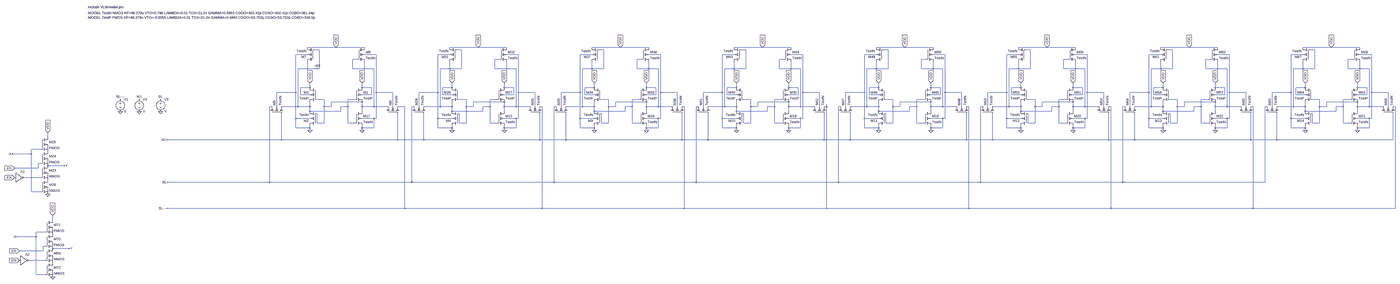
[diagram p0: schematic 40nmDraft1.asc, whole sheet]
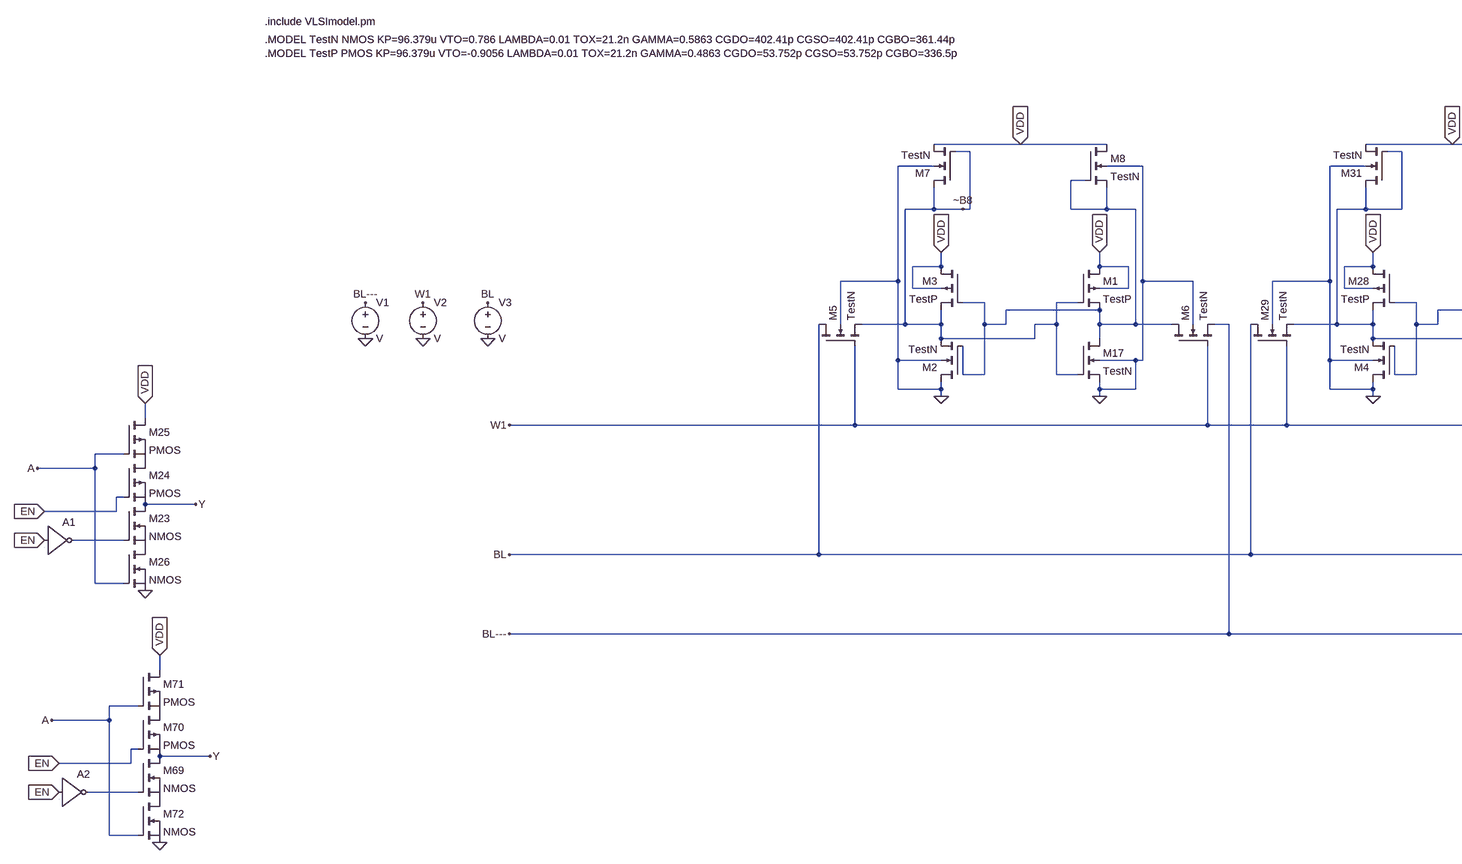
[diagram p1: schematic 40nmDraft1.asc, part, row 1 of 1, column 1 of 3]
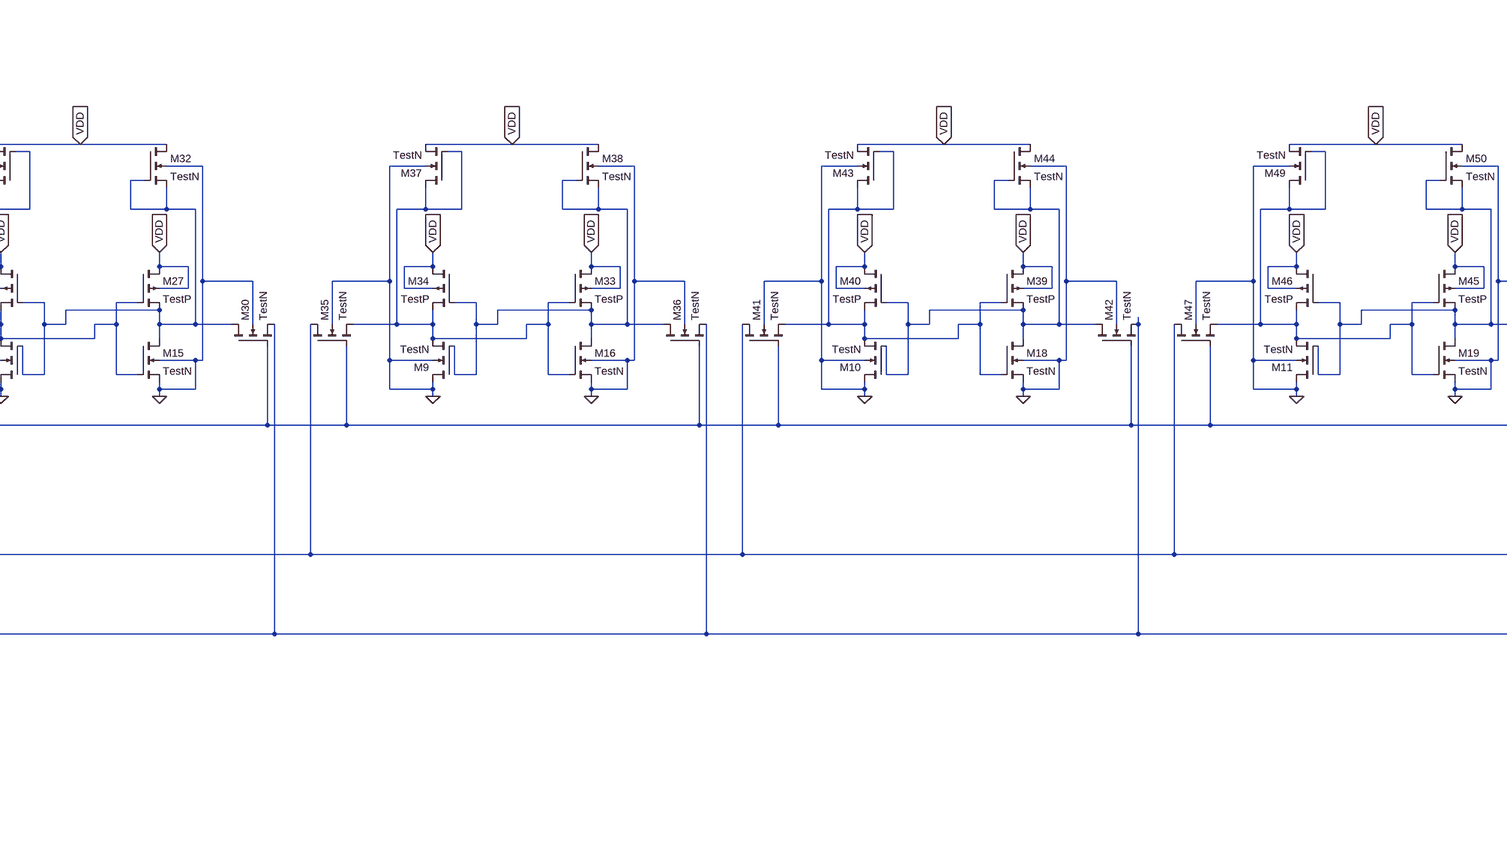
[diagram p2: schematic 40nmDraft1.asc, part, row 1 of 1, column 2 of 3]
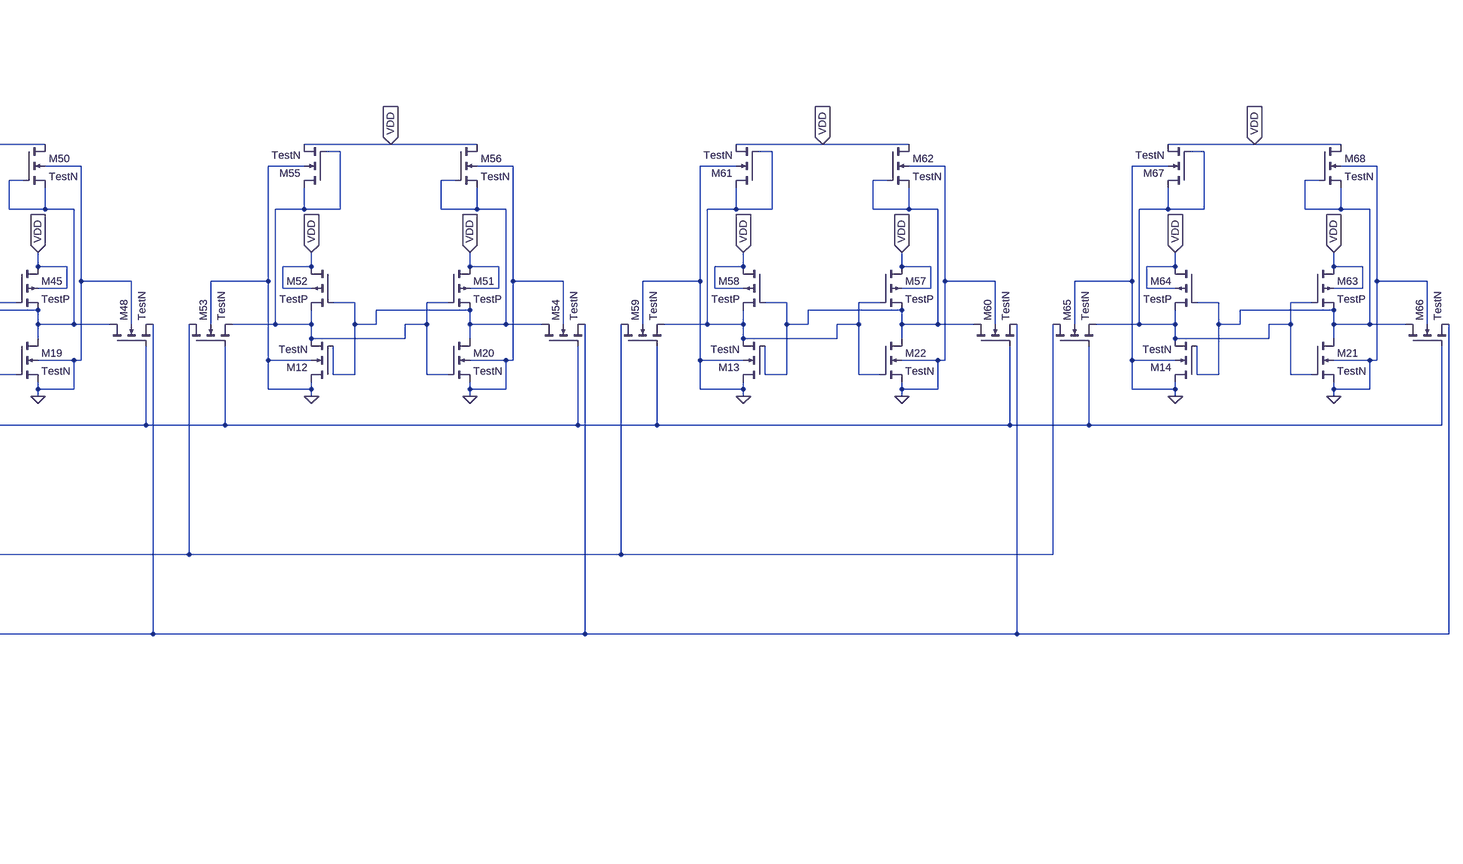
[diagram p3: schematic 40nmDraft1.asc, part, row 1 of 1, column 3 of 3]
40nmDraft1.asc, the LTspice schematic file:
Version 4
SHEET 1 5016 1524
WIRE -2144 -48 -2336 -48
WIRE -1952 -48 -2144 -48
WIRE -1184 -48 -1376 -48
WIRE -992 -48 -1184 -48
WIRE -224 -48 -416 -48
WIRE -32 -48 -224 -48
WIRE 736 -48 544 -48
WIRE 928 -48 736 -48
WIRE 1696 -48 1504 -48
WIRE 1888 -48 1696 -48
WIRE 2656 -48 2464 -48
WIRE 2848 -48 2656 -48
WIRE 3616 -48 3424 -48
WIRE 3808 -48 3616 -48
WIRE 4576 -48 4384 -48
WIRE 4768 -48 4576 -48
WIRE -2256 -32 -2288 -32
WIRE -1296 -32 -1328 -32
WIRE -336 -32 -368 -32
WIRE 624 -32 592 -32
WIRE 1584 -32 1552 -32
WIRE 2544 -32 2512 -32
WIRE 3504 -32 3472 -32
WIRE 4464 -32 4432 -32
WIRE -2336 0 -2416 0
WIRE -1872 0 -1952 0
WIRE -1376 0 -1456 0
WIRE -912 0 -992 0
WIRE -416 0 -496 0
WIRE 48 0 -32 0
WIRE 544 0 464 0
WIRE 1008 0 928 0
WIRE 1504 0 1424 0
WIRE 1968 0 1888 0
WIRE 2464 0 2384 0
WIRE 2928 0 2848 0
WIRE 3424 0 3344 0
WIRE 3888 0 3808 0
WIRE 4384 0 4304 0
WIRE 4848 0 4768 0
WIRE -2000 32 -2032 32
WIRE -1040 32 -1072 32
WIRE -80 32 -112 32
WIRE 880 32 848 32
WIRE 1840 32 1808 32
WIRE 2800 32 2768 32
WIRE 3760 32 3728 32
WIRE 4720 32 4688 32
WIRE -2336 96 -2336 48
WIRE -2336 96 -2400 96
WIRE -2272 96 -2336 96
WIRE -2256 96 -2256 -32
WIRE -2256 96 -2272 96
WIRE -2032 96 -2032 32
WIRE -1952 96 -1952 48
WIRE -1952 96 -2032 96
WIRE -1888 96 -1952 96
WIRE -1376 96 -1376 48
WIRE -1376 96 -1440 96
WIRE -1296 96 -1296 -32
WIRE -1296 96 -1376 96
WIRE -1072 96 -1072 32
WIRE -992 96 -992 48
WIRE -992 96 -1072 96
WIRE -928 96 -992 96
WIRE -416 96 -416 48
WIRE -416 96 -480 96
WIRE -336 96 -336 -32
WIRE -336 96 -416 96
WIRE -112 96 -112 32
WIRE -32 96 -32 48
WIRE -32 96 -112 96
WIRE 32 96 -32 96
WIRE 544 96 544 48
WIRE 544 96 480 96
WIRE 624 96 624 -32
WIRE 624 96 544 96
WIRE 848 96 848 32
WIRE 928 96 928 48
WIRE 928 96 848 96
WIRE 992 96 928 96
WIRE 1504 96 1504 48
WIRE 1504 96 1440 96
WIRE 1584 96 1584 -32
WIRE 1584 96 1504 96
WIRE 1808 96 1808 32
WIRE 1888 96 1888 48
WIRE 1888 96 1808 96
WIRE 1952 96 1888 96
WIRE 2464 96 2464 48
WIRE 2464 96 2400 96
WIRE 2544 96 2544 -32
WIRE 2544 96 2464 96
WIRE 2768 96 2768 32
WIRE 2848 96 2848 48
WIRE 2848 96 2768 96
WIRE 2912 96 2848 96
WIRE 3424 96 3424 48
WIRE 3424 96 3360 96
WIRE 3504 96 3504 -32
WIRE 3504 96 3424 96
WIRE 3728 96 3728 32
WIRE 3808 96 3808 48
WIRE 3808 96 3728 96
WIRE 3872 96 3808 96
WIRE 4384 96 4384 48
WIRE 4384 96 4320 96
WIRE 4464 96 4464 -32
WIRE 4464 96 4384 96
WIRE 4688 96 4688 32
WIRE 4768 96 4768 48
WIRE 4768 96 4688 96
WIRE 4832 96 4768 96
WIRE -2320 224 -2320 192
WIRE -2320 224 -2384 224
WIRE -1968 224 -1968 192
WIRE -1904 224 -1968 224
WIRE -1360 224 -1360 192
WIRE -1360 224 -1424 224
WIRE -1008 224 -1008 192
WIRE -944 224 -1008 224
WIRE -400 224 -400 192
WIRE -400 224 -464 224
WIRE -48 224 -48 192
WIRE 16 224 -48 224
WIRE 560 224 560 192
WIRE 560 224 496 224
WIRE 912 224 912 192
WIRE 976 224 912 224
WIRE 1520 224 1520 192
WIRE 1520 224 1456 224
WIRE 1872 224 1872 192
WIRE 1936 224 1872 224
WIRE 2480 224 2480 192
WIRE 2480 224 2416 224
WIRE 2832 224 2832 192
WIRE 2896 224 2832 224
WIRE 3440 224 3440 192
WIRE 3440 224 3376 224
WIRE 3792 224 3792 192
WIRE 3856 224 3792 224
WIRE 4400 224 4400 192
WIRE 4400 224 4336 224
WIRE 4752 224 4752 192
WIRE 4816 224 4752 224
WIRE -2416 256 -2416 0
WIRE -2416 256 -2544 256
WIRE -1872 256 -1872 0
WIRE -1760 256 -1872 256
WIRE -1456 256 -1456 0
WIRE -1456 256 -1584 256
WIRE -912 256 -912 0
WIRE -800 256 -912 256
WIRE -496 256 -496 0
WIRE -496 256 -624 256
WIRE 48 256 48 0
WIRE 160 256 48 256
WIRE 464 256 464 0
WIRE 464 256 336 256
WIRE 1008 256 1008 0
WIRE 1120 256 1008 256
WIRE 1424 256 1424 0
WIRE 1424 256 1296 256
WIRE 1968 256 1968 0
WIRE 2080 256 1968 256
WIRE 2384 256 2384 0
WIRE 2384 256 2256 256
WIRE 2928 256 2928 0
WIRE 3040 256 2928 256
WIRE 3344 256 3344 0
WIRE 3344 256 3216 256
WIRE 3888 256 3888 0
WIRE 4000 256 3888 256
WIRE 4304 256 4304 0
WIRE 4304 256 4176 256
WIRE 4848 256 4848 0
WIRE 4960 256 4848 256
WIRE -2384 272 -2384 224
WIRE -2320 272 -2384 272
WIRE -1904 272 -1904 224
WIRE -1904 272 -1968 272
WIRE -1424 272 -1424 224
WIRE -1360 272 -1424 272
WIRE -944 272 -944 224
WIRE -944 272 -1008 272
WIRE -464 272 -464 224
WIRE -400 272 -464 272
WIRE 16 272 16 224
WIRE 16 272 -48 272
WIRE 496 272 496 224
WIRE 560 272 496 272
WIRE 976 272 976 224
WIRE 976 272 912 272
WIRE 1456 272 1456 224
WIRE 1520 272 1456 272
WIRE 1936 272 1936 224
WIRE 1936 272 1872 272
WIRE 2416 272 2416 224
WIRE 2480 272 2416 272
WIRE 2896 272 2896 224
WIRE 2896 272 2832 272
WIRE 3376 272 3376 224
WIRE 3440 272 3376 272
WIRE 3856 272 3856 224
WIRE 3856 272 3792 272
WIRE 4336 272 4336 224
WIRE 4400 272 4336 272
WIRE 4816 272 4816 224
WIRE 4816 272 4752 272
WIRE -2224 304 -2272 304
WIRE -2016 304 -2064 304
WIRE -1264 304 -1312 304
WIRE -1056 304 -1104 304
WIRE -304 304 -352 304
WIRE -96 304 -144 304
WIRE 656 304 608 304
WIRE 864 304 816 304
WIRE 1616 304 1568 304
WIRE 1824 304 1776 304
WIRE 2576 304 2528 304
WIRE 2784 304 2736 304
WIRE 3536 304 3488 304
WIRE 3744 304 3696 304
WIRE 4496 304 4448 304
WIRE 4704 304 4656 304
WIRE -1968 320 -2176 320
WIRE -1008 320 -1216 320
WIRE -48 320 -256 320
WIRE 912 320 704 320
WIRE 1872 320 1664 320
WIRE 2832 320 2624 320
WIRE 3792 320 3584 320
WIRE 4752 320 4544 320
WIRE -2544 352 -2544 256
WIRE -2400 352 -2400 96
WIRE -2400 352 -2496 352
WIRE -2320 352 -2320 320
WIRE -2320 352 -2400 352
WIRE -2224 352 -2224 304
WIRE -2176 352 -2176 320
WIRE -2176 352 -2224 352
WIRE -2064 352 -2064 304
WIRE -2064 352 -2112 352
WIRE -1968 352 -1968 320
WIRE -1888 352 -1888 96
WIRE -1888 352 -1968 352
WIRE -1808 352 -1888 352
WIRE -1760 352 -1760 256
WIRE -1680 352 -1712 352
WIRE -1584 352 -1584 256
WIRE -1440 352 -1440 96
WIRE -1440 352 -1536 352
WIRE -1360 352 -1360 320
WIRE -1360 352 -1440 352
WIRE -1264 352 -1264 304
WIRE -1216 352 -1216 320
WIRE -1216 352 -1264 352
WIRE -1104 352 -1104 304
WIRE -1104 352 -1152 352
WIRE -1008 352 -1008 320
WIRE -928 352 -928 96
WIRE -928 352 -1008 352
WIRE -848 352 -928 352
WIRE -800 352 -800 256
WIRE -624 352 -624 256
WIRE -480 352 -480 96
WIRE -480 352 -576 352
WIRE -400 352 -400 320
WIRE -400 352 -480 352
WIRE -304 352 -304 304
WIRE -256 352 -256 320
WIRE -256 352 -304 352
WIRE -144 352 -144 304
WIRE -144 352 -192 352
WIRE -48 352 -48 320
WIRE 32 352 32 96
WIRE 32 352 -48 352
WIRE 112 352 32 352
WIRE 160 352 160 256
WIRE 336 352 336 256
WIRE 480 352 480 96
WIRE 480 352 384 352
WIRE 560 352 560 320
WIRE 560 352 480 352
WIRE 656 352 656 304
WIRE 704 352 704 320
WIRE 704 352 656 352
WIRE 816 352 816 304
WIRE 816 352 768 352
WIRE 912 352 912 320
WIRE 992 352 992 96
WIRE 992 352 912 352
WIRE 1072 352 992 352
WIRE 1120 352 1120 256
WIRE 1168 352 1168 336
WIRE 1296 352 1296 256
WIRE 1440 352 1440 96
WIRE 1440 352 1344 352
WIRE 1520 352 1520 320
WIRE 1520 352 1440 352
WIRE 1616 352 1616 304
WIRE 1664 352 1664 320
WIRE 1664 352 1616 352
WIRE 1776 352 1776 304
WIRE 1776 352 1728 352
WIRE 1872 352 1872 320
WIRE 1952 352 1952 96
WIRE 1952 352 1872 352
WIRE 2032 352 1952 352
WIRE 2080 352 2080 256
WIRE 2256 352 2256 256
WIRE 2400 352 2400 96
WIRE 2400 352 2304 352
WIRE 2480 352 2480 320
WIRE 2480 352 2400 352
WIRE 2576 352 2576 304
WIRE 2624 352 2624 320
WIRE 2624 352 2576 352
WIRE 2736 352 2736 304
WIRE 2736 352 2688 352
WIRE 2832 352 2832 320
WIRE 2912 352 2912 96
WIRE 2912 352 2832 352
WIRE 2992 352 2912 352
WIRE 3040 352 3040 256
WIRE 3216 352 3216 256
WIRE 3360 352 3360 96
WIRE 3360 352 3264 352
WIRE 3440 352 3440 320
WIRE 3440 352 3360 352
WIRE 3536 352 3536 304
WIRE 3584 352 3584 320
WIRE 3584 352 3536 352
WIRE 3696 352 3696 304
WIRE 3696 352 3648 352
WIRE 3792 352 3792 320
WIRE 3872 352 3872 96
WIRE 3872 352 3792 352
WIRE 3952 352 3872 352
WIRE 4000 352 4000 256
WIRE 4176 352 4176 256
WIRE 4320 352 4320 96
WIRE 4320 352 4224 352
WIRE 4400 352 4400 320
WIRE 4400 352 4320 352
WIRE 4496 352 4496 304
WIRE 4544 352 4544 320
WIRE 4544 352 4496 352
WIRE 4656 352 4656 304
WIRE 4656 352 4608 352
WIRE 4752 352 4752 320
WIRE 4832 352 4832 96
WIRE 4832 352 4752 352
WIRE 4912 352 4832 352
WIRE 4960 352 4960 256
WIRE -2320 384 -2320 352
WIRE -2112 384 -2112 352
WIRE -2112 384 -2320 384
WIRE -1968 384 -1968 352
WIRE -1360 384 -1360 352
WIRE -1152 384 -1152 352
WIRE -1152 384 -1360 384
WIRE -1008 384 -1008 352
WIRE -400 384 -400 352
WIRE -192 384 -192 352
WIRE -192 384 -400 384
WIRE -48 384 -48 352
WIRE 560 384 560 352
WIRE 768 384 768 352
WIRE 768 384 560 384
WIRE 912 384 912 352
WIRE 1520 384 1520 352
WIRE 1728 384 1728 352
WIRE 1728 384 1520 384
WIRE 1872 384 1872 352
WIRE 2480 384 2480 352
WIRE 2688 384 2688 352
WIRE 2688 384 2480 384
WIRE 2832 384 2832 352
WIRE 3440 384 3440 352
WIRE 3648 384 3648 352
WIRE 3648 384 3440 384
WIRE 3792 384 3792 352
WIRE 4400 384 4400 352
WIRE 4608 384 4608 352
WIRE 4608 384 4400 384
WIRE 4752 384 4752 352
WIRE -2416 432 -2416 256
WIRE -2320 432 -2416 432
WIRE -1888 432 -1968 432
WIRE -1872 432 -1872 256
WIRE -1872 432 -1888 432
WIRE -1456 432 -1456 256
WIRE -1360 432 -1456 432
WIRE -928 432 -1008 432
WIRE -912 432 -912 256
WIRE -912 432 -928 432
WIRE -496 432 -496 256
WIRE -400 432 -496 432
WIRE 32 432 -48 432
WIRE 48 432 48 256
WIRE 48 432 32 432
WIRE 464 432 464 256
WIRE 560 432 464 432
WIRE 992 432 912 432
WIRE 1008 432 1008 256
WIRE 1008 432 992 432
WIRE 1424 432 1424 256
WIRE 1520 432 1424 432
WIRE 1952 432 1872 432
WIRE 1968 432 1968 256
WIRE 1968 432 1952 432
WIRE 2384 432 2384 256
WIRE 2480 432 2384 432
WIRE 2912 432 2832 432
WIRE 2928 432 2928 256
WIRE 2928 432 2912 432
WIRE 3344 432 3344 256
WIRE 3440 432 3344 432
WIRE 3872 432 3792 432
WIRE 3888 432 3888 256
WIRE 3888 432 3872 432
WIRE 4304 432 4304 256
WIRE 4400 432 4304 432
WIRE 4832 432 4752 432
WIRE 4848 432 4848 256
WIRE 4848 432 4832 432
WIRE -2272 464 -2272 400
WIRE -2224 464 -2224 352
WIRE -2224 464 -2272 464
WIRE -2064 464 -2064 352
WIRE -2016 464 -2064 464
WIRE -1312 464 -1312 400
WIRE -1264 464 -1264 352
WIRE -1264 464 -1312 464
WIRE -1104 464 -1104 352
WIRE -1056 464 -1104 464
WIRE -352 464 -352 400
WIRE -304 464 -304 352
WIRE -304 464 -352 464
WIRE -144 464 -144 352
WIRE -96 464 -144 464
WIRE 608 464 608 400
WIRE 656 464 656 352
WIRE 656 464 608 464
WIRE 816 464 816 352
WIRE 864 464 816 464
WIRE 1568 464 1568 400
WIRE 1616 464 1616 352
WIRE 1616 464 1568 464
WIRE 1776 464 1776 352
WIRE 1824 464 1776 464
WIRE 2528 464 2528 400
WIRE 2576 464 2576 352
WIRE 2576 464 2528 464
WIRE 2736 464 2736 352
WIRE 2784 464 2736 464
WIRE 3488 464 3488 400
WIRE 3536 464 3536 352
WIRE 3536 464 3488 464
WIRE 3696 464 3696 352
WIRE 3744 464 3696 464
WIRE 4448 464 4448 400
WIRE 4496 464 4496 352
WIRE 4496 464 4448 464
WIRE 4656 464 4656 352
WIRE 4704 464 4656 464
WIRE -2416 496 -2416 432
WIRE -2320 496 -2320 480
WIRE -2320 496 -2416 496
WIRE -1968 496 -1968 480
WIRE -1888 496 -1888 432
WIRE -1888 496 -1968 496
WIRE -1456 496 -1456 432
WIRE -1360 496 -1360 480
WIRE -1360 496 -1456 496
WIRE -1008 496 -1008 480
WIRE -928 496 -928 432
WIRE -928 496 -1008 496
WIRE -496 496 -496 432
WIRE -400 496 -400 480
WIRE -400 496 -496 496
WIRE -48 496 -48 480
WIRE 32 496 32 432
WIRE 32 496 -48 496
WIRE 464 496 464 432
WIRE 560 496 560 480
WIRE 560 496 464 496
WIRE 912 496 912 480
WIRE 992 496 992 432
WIRE 992 496 912 496
WIRE 1424 496 1424 432
WIRE 1520 496 1520 480
WIRE 1520 496 1424 496
WIRE 1872 496 1872 480
WIRE 1952 496 1952 432
WIRE 1952 496 1872 496
WIRE 2384 496 2384 432
WIRE 2480 496 2480 480
WIRE 2480 496 2384 496
WIRE 2832 496 2832 480
WIRE 2912 496 2912 432
WIRE 2912 496 2832 496
WIRE 3344 496 3344 432
WIRE 3440 496 3440 480
WIRE 3440 496 3344 496
WIRE 3792 496 3792 480
WIRE 3872 496 3872 432
WIRE 3872 496 3792 496
WIRE 4304 496 4304 432
WIRE 4400 496 4400 480
WIRE 4400 496 4304 496
WIRE 4752 496 4752 480
WIRE 4832 496 4832 432
WIRE 4832 496 4752 496
WIRE -2320 512 -2320 496
WIRE -1968 512 -1968 496
WIRE -1360 512 -1360 496
WIRE -1008 512 -1008 496
WIRE -400 512 -400 496
WIRE -48 512 -48 496
WIRE 560 512 560 496
WIRE 912 512 912 496
WIRE 1520 512 1520 496
WIRE 1872 512 1872 496
WIRE 2480 512 2480 496
WIRE 2832 512 2832 496
WIRE 3440 512 3440 496
WIRE 3792 512 3792 496
WIRE 4400 512 4400 496
WIRE 4752 512 4752 496
WIRE -4096 560 -4096 528
WIRE -2512 576 -2512 400
WIRE -2512 576 -3280 576
WIRE -1728 576 -1728 400
WIRE -1728 576 -2512 576
WIRE -1552 576 -1552 400
WIRE -1552 576 -1728 576
WIRE -768 576 -768 400
WIRE -768 576 -1552 576
WIRE -592 576 -592 400
WIRE -592 576 -768 576
WIRE 192 576 192 400
WIRE 192 576 -592 576
WIRE 368 576 368 400
WIRE 368 576 192 576
WIRE 1152 576 1152 400
WIRE 1152 576 368 576
WIRE 1328 576 1328 400
WIRE 1328 576 1152 576
WIRE 2112 576 2112 400
WIRE 2112 576 1328 576
WIRE 2288 576 2288 400
WIRE 2288 576 2112 576
WIRE 3072 576 3072 400
WIRE 3072 576 2288 576
WIRE 3248 576 3248 400
WIRE 3248 576 3072 576
WIRE 4032 576 4032 400
WIRE 4032 576 3248 576
WIRE 4208 576 4208 400
WIRE 4208 576 4032 576
WIRE 4992 576 4992 400
WIRE 4992 576 4208 576
WIRE -4144 640 -4208 640
WIRE -4208 672 -4208 640
WIRE -4208 672 -4336 672
WIRE -4144 736 -4160 736
WIRE -3984 752 -4096 752
WIRE -4160 768 -4160 736
WIRE -4160 768 -4320 768
WIRE -4144 832 -4256 832
WIRE -2592 864 -2592 352
WIRE -2592 864 -3280 864
WIRE -1632 864 -1632 352
WIRE -1632 864 -2592 864
WIRE -672 864 -672 352
WIRE -672 864 -1632 864
WIRE 288 864 288 352
WIRE 288 864 -672 864
WIRE 1248 864 1248 352
WIRE 1248 864 288 864
WIRE 2208 864 2208 352
WIRE 2208 864 1248 864
WIRE 3168 864 3168 352
WIRE 3168 864 2208 864
WIRE 4128 864 4128 352
WIRE 4128 864 3168 864
WIRE -4208 928 -4208 672
WIRE -4144 928 -4208 928
WIRE -1680 1040 -1680 352
WIRE -1680 1040 -3280 1040
WIRE -752 1040 -752 352
WIRE -752 1040 -1680 1040
WIRE 208 1040 208 352
WIRE 208 1040 -752 1040
WIRE 1168 1040 1168 352
WIRE 1168 1040 208 1040
WIRE 2128 1040 2128 352
WIRE 2128 1040 1168 1040
WIRE 3088 1040 3088 352
WIRE 3088 1040 2128 1040
WIRE 4048 1040 4048 352
WIRE 4048 1040 3088 1040
WIRE 5008 1040 5008 352
WIRE 5008 1040 4048 1040
WIRE -4064 1120 -4064 1088
WIRE -4112 1200 -4176 1200
WIRE -4176 1232 -4176 1200
WIRE -4176 1232 -4304 1232
WIRE -4112 1296 -4128 1296
WIRE -3952 1312 -4064 1312
WIRE -4128 1328 -4128 1296
WIRE -4128 1328 -4288 1328
WIRE -4112 1392 -4224 1392
WIRE -4176 1488 -4176 1232
WIRE -4112 1488 -4176 1488
FLAG -1968 512 0
FLAG -2144 -48 VDD
IOPIN -2144 -48 In
FLAG -1968 192 VDD
IOPIN -1968 192 In
FLAG -2320 512 0
FLAG -2320 192 VDD
IOPIN -2320 192 In
FLAG -1008 512 0
FLAG -1184 -48 VDD
IOPIN -1184 -48 In
FLAG -1008 192 VDD
IOPIN -1008 192 In
FLAG -1360 512 0
FLAG -1360 192 VDD
IOPIN -1360 192 In
FLAG -48 512 0
FLAG -224 -48 VDD
IOPIN -224 -48 In
FLAG -48 192 VDD
IOPIN -48 192 In
FLAG -400 512 0
FLAG -400 192 VDD
IOPIN -400 192 In
FLAG 912 512 0
FLAG 736 -48 VDD
IOPIN 736 -48 In
FLAG 912 192 VDD
IOPIN 912 192 In
FLAG 560 512 0
FLAG 560 192 VDD
IOPIN 560 192 In
FLAG 1872 512 0
FLAG 1696 -48 VDD
IOPIN 1696 -48 In
FLAG 1872 192 VDD
IOPIN 1872 192 In
FLAG 1520 512 0
FLAG 1520 192 VDD
IOPIN 1520 192 In
FLAG 2832 512 0
FLAG 2656 -48 VDD
IOPIN 2656 -48 In
FLAG 2832 192 VDD
IOPIN 2832 192 In
FLAG 2480 512 0
FLAG 2480 192 VDD
IOPIN 2480 192 In
FLAG 3792 512 0
FLAG 3616 -48 VDD
IOPIN 3616 -48 In
FLAG 3792 192 VDD
IOPIN 3792 192 In
FLAG 3440 512 0
FLAG 3440 192 VDD
IOPIN 3440 192 In
FLAG 4752 512 0
FLAG 4576 -48 VDD
IOPIN 4576 -48 In
FLAG 4752 192 VDD
IOPIN 4752 192 In
FLAG 4400 512 0
FLAG 4400 192 VDD
IOPIN 4400 192 In
FLAG -3280 576 W1
FLAG -2272 96 ~B8
FLAG -3280 864 BL
FLAG -3280 1040 BL---
FLAG -3472 304 W1
FLAG -3328 304 BL
FLAG -3600 304 BL---
FLAG -3472 384 0
FLAG -3328 384 0
FLAG -3600 384 0
FLAG -4096 944 0
FLAG -3984 752 Y
FLAG -4336 672 A
FLAG -4320 768 EN
IOPIN -4320 768 In
FLAG -4320 832 EN
IOPIN -4320 832 In
FLAG -4096 528 VDD
IOPIN -4096 528 In
FLAG -4064 1504 0
FLAG -3952 1312 Y
FLAG -4304 1232 A
FLAG -4288 1328 EN
IOPIN -4288 1328 In
FLAG -4288 1392 EN
IOPIN -4288 1392 In
FLAG -4064 1088 VDD
IOPIN -4064 1088 In
SYMBOL pmos4 -2016 224 R0
SYMATTR InstName M1
SYMATTR Value TestP
SYMATTR Value2 l=10u w=40u
SYMBOL pmos4 -2272 224 M0
SYMATTR InstName M3
SYMATTR Value TestP
SYMATTR Value2 l=10u w=40u
SYMBOL nmos4 -2592 400 R270
SYMATTR InstName M5
SYMATTR Value TestN
SYMATTR Value2 l=10u w=20u
SYMBOL nmos4 -1808 400 R270
SYMATTR InstName M6
SYMATTR Value TestN
SYMATTR Value2 l=10u w=20u
SYMBOL nmos4 -2288 48 R180
SYMATTR InstName M7
SYMATTR Value TestN
SYMATTR Value2 l=10u w=20u
SYMBOL nmos4 -2000 -48 R0
SYMATTR InstName M8
SYMATTR Value TestN
SYMATTR Value2 l=10u w=20u
SYMBOL pmos4 -1056 224 R0
SYMATTR InstName M27
SYMATTR Value TestP
SYMATTR Value2 l=10u w=40u
SYMBOL pmos4 -1312 224 M0
SYMATTR InstName M28
SYMATTR Value TestP
SYMATTR Value2 l=10u w=40u
SYMBOL nmos4 -1632 400 R270
SYMATTR InstName M29
SYMATTR Value TestN
SYMATTR Value2 l=10u w=20u
SYMBOL nmos4 -848 400 R270
SYMATTR InstName M30
SYMATTR Value TestN
SYMATTR Value2 l=10u w=20u
SYMBOL nmos4 -1328 48 R180
SYMATTR InstName M31
SYMATTR Value TestN
SYMATTR Value2 l=10u w=20u
SYMBOL nmos4 -1040 -48 R0
SYMATTR InstName M32
SYMATTR Value TestN
SYMATTR Value2 l=10u w=20u
SYMBOL pmos4 -96 224 R0
SYMATTR InstName M33
SYMATTR Value TestP
SYMATTR Value2 l=10u w=40u
SYMBOL pmos4 -352 224 M0
SYMATTR InstName M34
SYMATTR Value TestP
SYMATTR Value2 l=10u w=40u
SYMBOL nmos4 -672 400 R270
SYMATTR InstName M35
SYMATTR Value TestN
SYMATTR Value2 l=10u w=20u
SYMBOL nmos4 112 400 R270
SYMATTR InstName M36
SYMATTR Value TestN
SYMATTR Value2 l=10u w=20u
SYMBOL nmos4 -368 48 R180
SYMATTR InstName M37
SYMATTR Value TestN
SYMATTR Value2 l=10u w=20u
SYMBOL nmos4 -80 -48 R0
SYMATTR InstName M38
SYMATTR Value TestN
SYMATTR Value2 l=10u w=20u
SYMBOL pmos4 864 224 R0
SYMATTR InstName M39
SYMATTR Value TestP
SYMATTR Value2 l=10u w=40u
SYMBOL pmos4 608 224 M0
SYMATTR InstName M40
SYMATTR Value TestP
SYMATTR Value2 l=10u w=40u
SYMBOL nmos4 288 400 R270
SYMATTR InstName M41
SYMATTR Value TestN
SYMATTR Value2 l=10u w=20u
SYMBOL nmos4 1072 400 R270
SYMATTR InstName M42
SYMATTR Value TestN
SYMATTR Value2 l=10u w=20u
SYMBOL nmos4 592 48 R180
SYMATTR InstName M43
SYMATTR Value TestN
SYMATTR Value2 l=10u w=20u
SYMBOL nmos4 880 -48 R0
SYMATTR InstName M44
SYMATTR Value TestN
SYMATTR Value2 l=10u w=20u
SYMBOL pmos4 1824 224 R0
SYMATTR InstName M45
SYMATTR Value TestP
SYMATTR Value2 l=10u w=40u
SYMBOL pmos4 1568 224 M0
SYMATTR InstName M46
SYMATTR Value TestP
SYMATTR Value2 l=10u w=40u
SYMBOL nmos4 1248 400 R270
SYMATTR InstName M47
SYMATTR Value TestN
SYMATTR Value2 l=10u w=20u
SYMBOL nmos4 2032 400 R270
SYMATTR InstName M48
SYMATTR Value TestN
SYMATTR Value2 l=10u w=20u
SYMBOL nmos4 1552 48 R180
SYMATTR InstName M49
SYMATTR Value TestN
SYMATTR Value2 l=10u w=20u
SYMBOL nmos4 1840 -48 R0
SYMATTR InstName M50
SYMATTR Value TestN
SYMATTR Value2 l=10u w=20u
SYMBOL pmos4 2784 224 R0
SYMATTR InstName M51
SYMATTR Value TestP
SYMATTR Value2 l=10u w=40u
SYMBOL pmos4 2528 224 M0
SYMATTR InstName M52
SYMATTR Value TestP
SYMATTR Value2 l=10u w=40u
SYMBOL nmos4 2208 400 R270
SYMATTR InstName M53
SYMATTR Value TestN
SYMATTR Value2 l=10u w=20u
SYMBOL nmos4 2992 400 R270
SYMATTR InstName M54
SYMATTR Value TestN
SYMATTR Value2 l=10u w=20u
SYMBOL nmos4 2512 48 R180
SYMATTR InstName M55
SYMATTR Value TestN
SYMATTR Value2 l=10u w=20u
SYMBOL nmos4 2800 -48 R0
SYMATTR InstName M56
SYMATTR Value TestN
SYMATTR Value2 l=10u w=20u
SYMBOL pmos4 3744 224 R0
SYMATTR InstName M57
SYMATTR Value TestP
SYMATTR Value2 l=10u w=40u
SYMBOL pmos4 3488 224 M0
SYMATTR InstName M58
SYMATTR Value TestP
SYMATTR Value2 l=10u w=40u
SYMBOL nmos4 3168 400 R270
SYMATTR InstName M59
SYMATTR Value TestN
SYMATTR Value2 l=10u w=20u
SYMBOL nmos4 3952 400 R270
SYMATTR InstName M60
SYMATTR Value TestN
SYMATTR Value2 l=10u w=20u
SYMBOL nmos4 3472 48 R180
SYMATTR InstName M61
SYMATTR Value TestN
SYMATTR Value2 l=10u w=20u
SYMBOL nmos4 3760 -48 R0
SYMATTR InstName M62
SYMATTR Value TestN
SYMATTR Value2 l=10u w=20u
SYMBOL pmos4 4704 224 R0
SYMATTR InstName M63
SYMATTR Value TestP
SYMATTR Value2 l=10u w=40u
SYMBOL pmos4 4448 224 M0
SYMATTR InstName M64
SYMATTR Value TestP
SYMATTR Value2 l=10u w=40u
SYMBOL nmos4 4128 400 R270
SYMATTR InstName M65
SYMATTR Value TestN
SYMATTR Value2 l=10u w=20u
SYMBOL nmos4 4912 400 R270
SYMATTR InstName M66
SYMATTR Value TestN
SYMATTR Value2 l=10u w=20u
SYMBOL nmos4 4432 48 R180
SYMATTR InstName M67
SYMATTR Value TestN
SYMATTR Value2 l=10u w=20u
SYMBOL nmos4 4720 -48 R0
SYMATTR InstName M68
SYMATTR Value TestN
SYMATTR Value2 l=10u w=20u
SYMBOL nmos4 -2272 480 R180
SYMATTR InstName M2
SYMATTR Value TestN
SYMATTR Value2 l=10u w=20u
SYMBOL nmos4 -1312 480 R180
SYMATTR InstName M4
SYMATTR Value TestN
SYMATTR Value2 l=10u w=20u
SYMBOL nmos4 -352 480 R180
SYMATTR InstName M9
SYMATTR Value TestN
SYMATTR Value2 l=10u w=20u
SYMBOL nmos4 608 480 R180
SYMATTR InstName M10
SYMATTR Value TestN
SYMATTR Value2 l=10u w=20u
SYMBOL nmos4 1568 480 R180
SYMATTR InstName M11
SYMATTR Value TestN
SYMATTR Value2 l=10u w=20u
SYMBOL nmos4 2528 480 R180
SYMATTR InstName M12
SYMATTR Value TestN
SYMATTR Value2 l=10u w=20u
SYMBOL nmos4 3488 480 R180
SYMATTR InstName M13
SYMATTR Value TestN
SYMATTR Value2 l=10u w=20u
SYMBOL nmos4 4448 480 R180
SYMATTR InstName M14
SYMATTR Value TestN
SYMATTR Value2 l=10u w=20u
SYMBOL nmos4 -1056 384 R0
SYMATTR InstName M15
SYMATTR Value TestN
SYMATTR Value2 l=10u w=20u
SYMBOL nmos4 -96 384 R0
SYMATTR InstName M16
SYMATTR Value TestN
SYMATTR Value2 l=10u w=20u
SYMBOL nmos4 -2016 384 R0
SYMATTR InstName M17
SYMATTR Value TestN
SYMATTR Value2 l=10u w=20u
SYMBOL nmos4 864 384 R0
SYMATTR InstName M18
SYMATTR Value TestN
SYMATTR Value2 l=10u w=20u
SYMBOL nmos4 1824 384 R0
SYMATTR InstName M19
SYMATTR Value TestN
SYMATTR Value2 l=10u w=20u
SYMBOL nmos4 2784 384 R0
SYMATTR InstName M20
SYMATTR Value TestN
SYMATTR Value2 l=10u w=20u
SYMBOL nmos4 4704 384 R0
SYMATTR InstName M21
SYMATTR Value TestN
SYMATTR Value2 l=10u w=20u
SYMBOL nmos4 3744 384 R0
SYMATTR InstName M22
SYMATTR Value TestN
SYMATTR Value2 l=10u w=20u
SYMBOL voltage -3600 288 R0
SYMATTR InstName V1
SYMBOL voltage -3472 288 R0
SYMATTR InstName V2
SYMBOL voltage -3328 288 R0
SYMATTR InstName V3
SYMBOL nmos -4144 752 R0
SYMATTR InstName M23
SYMBOL pmos -4144 656 R0
SYMATTR InstName M24
SYMBOL pmos -4144 560 R0
SYMATTR InstName M25
SYMBOL nmos -4144 848 R0
SYMATTR InstName M26
SYMBOL Digital\\inv -4320 768 R0
SYMATTR InstName A1
SYMBOL nmos -4112 1312 R0
SYMATTR InstName M69
SYMBOL pmos -4112 1216 R0
SYMATTR InstName M70
SYMBOL pmos -4112 1120 R0
SYMATTR InstName M71
SYMBOL nmos -4112 1408 R0
SYMATTR InstName M72
SYMBOL Digital\\inv -4288 1328 R0
SYMATTR InstName A2
TEXT -3824 -1280 Left 2 !.include VLSImodel.pm
TEXT -3824 -1240 Left 2 !.MODEL TestN NMOS KP=96.379u VTO=0.786 LAMBDA=0.01 TOX=21.2n GAMMA=0.5863 CGDO=402.41p CGSO=402.41p CGBO=361.44p\n.MODEL TestP PMOS KP=96.379u VTO=-0.9056 LAMBDA=0.01 TOX=21.2n GAMMA=0.4863 CGDO=53.752p CGSO=53.752p CGBO=336.5p

The netlist it stands for:
* 40nmDraft1.asc
M1 VDD ~B8 N008 VDD TestP l=10u w=40u
M3 VDD N008 ~B8 VDD TestP l=10u w=40u
M5 BL W1 ~B8 0 TestN l=10u w=20u
M6 N008 W1 BL--- 0 TestN l=10u w=20u
M7 ~B8 ~B8 VDD 0 TestN l=10u w=20u
M8 VDD N008 N008 0 TestN l=10u w=20u
M27 VDD N001 N009 VDD TestP l=10u w=40u
M28 VDD N009 N001 VDD TestP l=10u w=40u
M29 BL W1 N001 0 TestN l=10u w=20u
M30 N009 W1 BL--- 0 TestN l=10u w=20u
M31 N001 N001 VDD 0 TestN l=10u w=20u
M32 VDD N009 N009 0 TestN l=10u w=20u
M33 VDD N002 N010 VDD TestP l=10u w=40u
M34 VDD N010 N002 VDD TestP l=10u w=40u
M35 BL W1 N002 0 TestN l=10u w=20u
M36 N010 W1 BL--- 0 TestN l=10u w=20u
M37 N002 N002 VDD 0 TestN l=10u w=20u
M38 VDD N010 N010 0 TestN l=10u w=20u
M39 VDD N003 N011 VDD TestP l=10u w=40u
M40 VDD N011 N003 VDD TestP l=10u w=40u
M41 BL W1 N003 0 TestN l=10u w=20u
M42 N011 W1 BL--- 0 TestN l=10u w=20u
M43 N003 N003 VDD 0 TestN l=10u w=20u
M44 VDD N011 N011 0 TestN l=10u w=20u
M45 VDD N004 N012 VDD TestP l=10u w=40u
M46 VDD N012 N004 VDD TestP l=10u w=40u
M47 BL W1 N004 0 TestN l=10u w=20u
M48 N012 W1 BL--- 0 TestN l=10u w=20u
M49 N004 N004 VDD 0 TestN l=10u w=20u
M50 VDD N012 N012 0 TestN l=10u w=20u
M51 VDD N005 N013 VDD TestP l=10u w=40u
M52 VDD N013 N005 VDD TestP l=10u w=40u
M53 BL W1 N005 0 TestN l=10u w=20u
M54 N013 W1 BL--- 0 TestN l=10u w=20u
M55 N005 N005 VDD 0 TestN l=10u w=20u
M56 VDD N013 N013 0 TestN l=10u w=20u
M57 VDD N006 N014 VDD TestP l=10u w=40u
M58 VDD N014 N006 VDD TestP l=10u w=40u
M59 BL W1 N006 0 TestN l=10u w=20u
M60 N014 W1 BL--- 0 TestN l=10u w=20u
M61 N006 N006 VDD 0 TestN l=10u w=20u
M62 VDD N014 N014 0 TestN l=10u w=20u
M63 VDD N007 N015 VDD TestP l=10u w=40u
M64 VDD N015 N007 VDD TestP l=10u w=40u
M65 BL W1 N007 0 TestN l=10u w=20u
M66 N015 W1 BL--- 0 TestN l=10u w=20u
M67 N007 N007 VDD 0 TestN l=10u w=20u
M68 VDD N015 N015 0 TestN l=10u w=20u
M2 0 N008 ~B8 0 TestN l=10u w=20u
M4 0 N009 N001 0 TestN l=10u w=20u
M9 0 N010 N002 0 TestN l=10u w=20u
M10 0 N011 N003 0 TestN l=10u w=20u
M11 0 N012 N004 0 TestN l=10u w=20u
M12 0 N013 N005 0 TestN l=10u w=20u
M13 0 N014 N006 0 TestN l=10u w=20u
M14 0 N015 N007 0 TestN l=10u w=20u
M15 N009 N001 0 0 TestN l=10u w=20u
M16 N010 N002 0 0 TestN l=10u w=20u
M17 N008 ~B8 0 0 TestN l=10u w=20u
M18 N011 N003 0 0 TestN l=10u w=20u
M19 N012 N004 0 0 TestN l=10u w=20u
M20 N013 N005 0 0 TestN l=10u w=20u
M21 N015 N007 0 0 TestN l=10u w=20u
M22 N014 N006 0 0 TestN l=10u w=20u
V1 BL--- 0 V
V2 W1 0 V
V3 BL 0 V
M23 Y N016 P001 P001 NMOS
M24 P002 EN Y Y PMOS
M25 VDD A P002 P002 PMOS
M26 P001 A 0 0 NMOS
A1 EN 0 0 0 0 N016 0 0 BUF
M69 Y N017 P003 P003 NMOS
M70 P004 EN Y Y PMOS
M71 VDD A P004 P004 PMOS
M72 P003 A 0 0 NMOS
A2 EN 0 0 0 0 N017 0 0 BUF
.model NMOS NMOS
.model PMOS PMOS
.lib standard.mos
.include VLSImodel.pm
.MODEL TestN NMOS KP=96.379u VTO=0.786 LAMBDA=0.01 TOX=21.2n GAMMA=0.5863 CGDO=402.41p CGSO=402.41p CGBO=361.44p
.MODEL TestP PMOS KP=96.379u VTO=-0.9056 LAMBDA=0.01 TOX=21.2n GAMMA=0.4863 CGDO=53.752p CGSO=53.752p CGBO=336.5p
.backanno
.end